# EAGLE board IoT4Bees-Ctrl_1V1 (EAGLE 7.7.0), part 1 of 2
DL0WH Antenna BiTuner
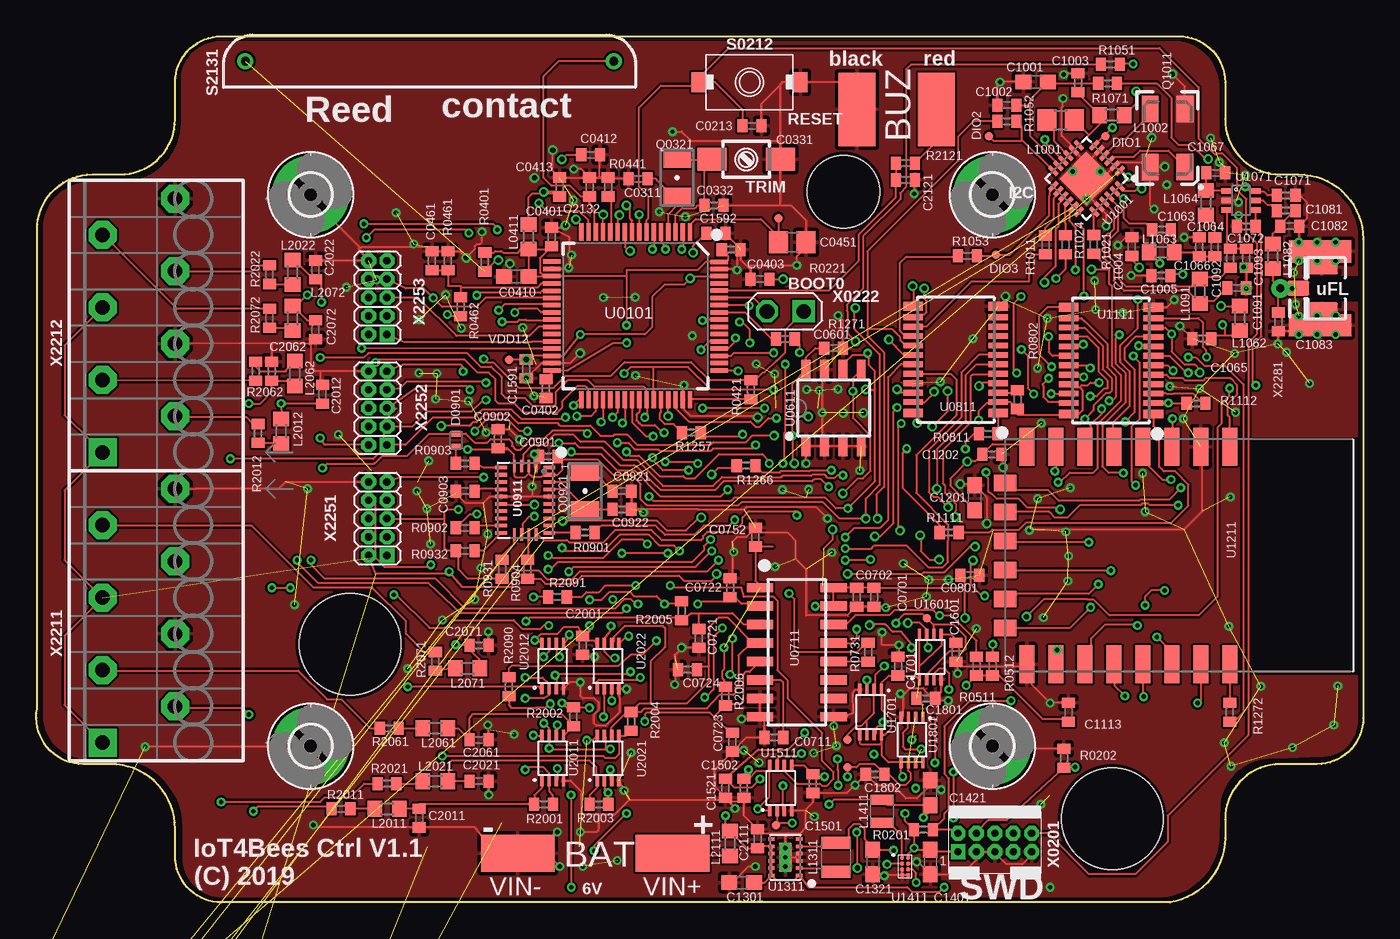
[diagram p23: board, top side]
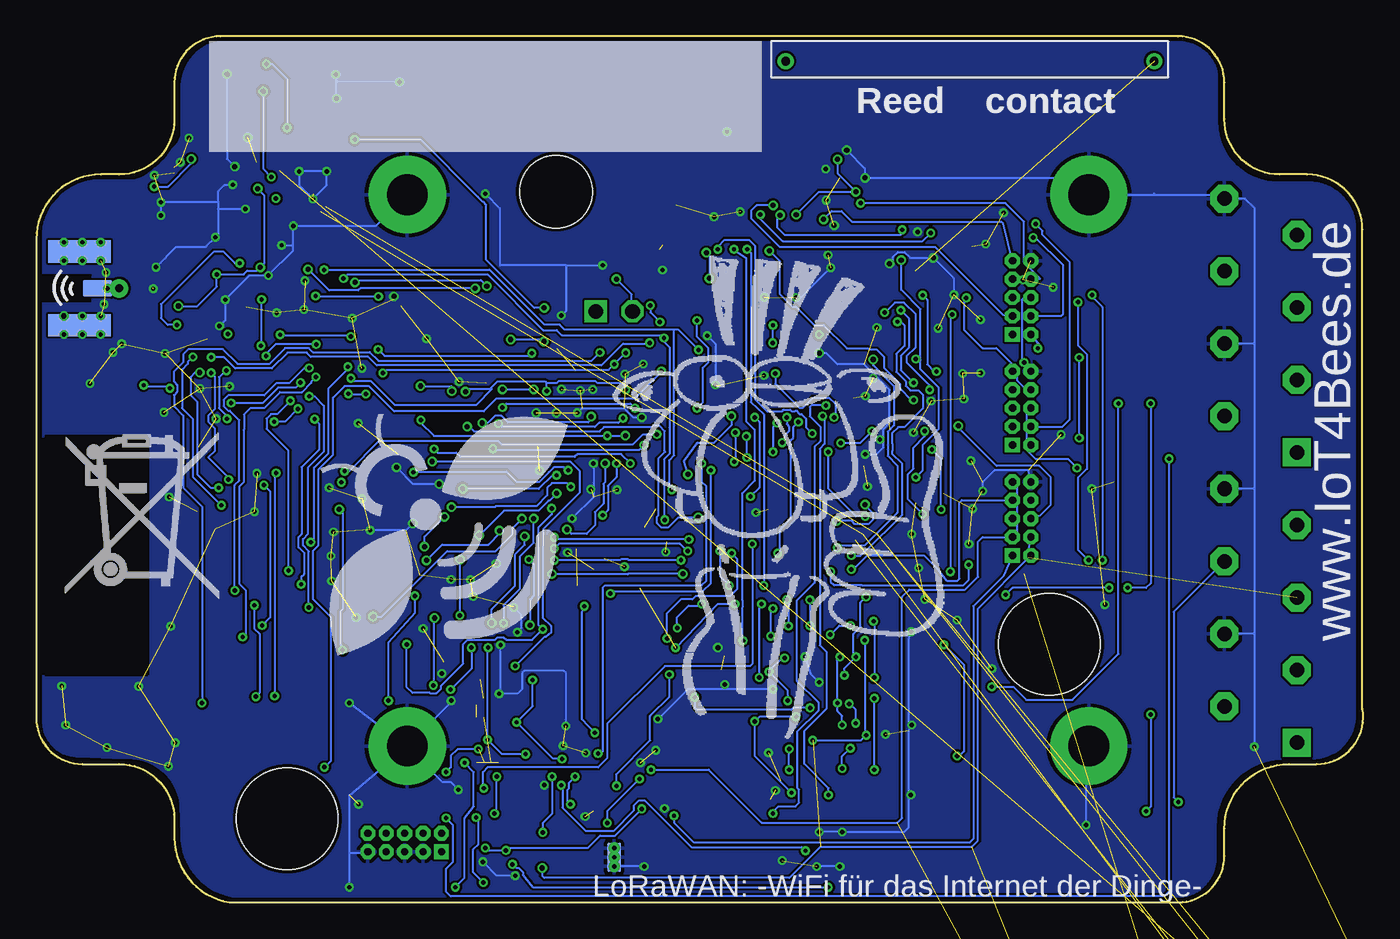
[diagram p24: board, bottom side, seen from below]

Size 91.49 x 59.69 mm. Coordinates in mm from the lower left corner, seen from the top.
Outline: 91.49,45.72 91.49,12.7 arc-90 88.32,9.53 85.78,9.53 arc90 81.97,5.72 81.97,4.45 arc-81 78.16,0 12.75,0 arc-90 9.58,3.18 9.58,5.08 arc90 5.13,9.53 3.23,9.53 arc-100 0.05,13.34 0.05,46.36 arc-90 3.86,50.17 5.77,50.17 arc90 9.58,53.98 9.58,56.52 arc-90 12.75,59.69 78.79,59.69 arc-90 81.97,56.52 81.97,53.98 arc90 85.78,50.17 87.05,50.17 arc-90 91.49,45.72
Copper layers (1*16): Top 0.035mm / dielectric 1.5mm / Bottom 0.035mm
Design rules "IoT4Bees-Ctrl_1V0 *": minimum track width 6mil, minimum drill 0.3mm, track to track 6mil, track to pad 6mil, pad to pad 6mil, via to via 6mil, smd to smd 0mil, copper to edge 10mil, drill to drill 10mil, minimum pad ring 10mil, minimum via ring 6mil, stop-mask expansion 2mil, vias tented up to drill 25mil, thermal gap 10mil
Net classes: 0 default: drill 0.3 mm; 1 pwr_relay: width 1.5 mm, clearance 0.5 mm; 2 pwr_ttl: width 0.75 mm, clearance 0.5 mm; 3 usb_pair: width 0.254 mm, clearance 0.152 mm; 4 pwrA5: width 0.4 mm; 5 single50R: width 0.838 mm, clearance 0.152 mm; 6 mil6_nofill: width 0.152 mm, clearance 0.254 mm
Holes 7 mm at 21.66,17.79 74.18,5.77
Holes 5 mm at 55.66,48.99
tKeepout: area 14.7,13.7 to 19.7,45.5
tRestrict: area 87.8,43 to 91.1,43.1; area 87.8,41.5 to 91.2,41.7; area 83.7,15.7 to 91.3,32
bRestrict: area 83.9,15.6 to 90.9,32.2; area 87.7,43 to 91.2,43.2; area 87.8,41.4 to 91.1,41.7; area 83.7,15.7 to 91.3,32

## Footprints (pad centres in the part's own frame; a part is rotated, then mirrored left to right if it is on the bottom)
SMD2,54-5,08 = smd 2.54 x 5.08: 1 0,0
C0402 = smd 0.7 x 0.9: 1 -0.65,0; 2 0.65,0
3MM2_X_2MM5 = smd 2 x 1.6: + -2.365,0; - 2.365,0
C0603 = smd 1.1 x 1: 1 -0.85,0; 2 0.85,0
C0805 = smd 1.3 x 1.5: 1 -0.95,0; 2 0.95,0
SOD923 = smd 0.4 x 0.6: A 0.45,0; C -0.45,0
2,8-PAD = drill 2.8 pad 5.334: B2,8 0,0
L0603 = smd 1 x 1.1: 1 -0.85,0; 2 0.85,0
L0805 = smd 1.3 x 1.5: 1 -0.95,0; 2 0.95,0
L2520 = smd 0.8 x 2: 1 -1,0; 2 1,0
L2016 = smd 0.7 x 1.6: 1 -0.8,0; 2 0.8,0
ABS07 = smd 1.1 x 1.9: 1 -1.25,0; 2 1.25,0
ABM3B = smd 1.8 x 1.2: 1 -2,-1.2; 2 2,-1.2; 3 2,1.2; 4 -2,1.2
R0402 = smd 0.7 x 0.9: 1 -0.65,0; 2 0.65,0
KSR223G_SMD_1POL = smd 1 x 1.4: 1 -3.5,0; 2 3.5,0
MK6-10 = drill 0.6 pad 1.016: 1 -12.7,0; 2 12.7,0
TP06R = smd 0.6 x 0.6: TP 0,0
LQFP64 = smd 1.2 x 0.3: 1 -5.775,3.75; 2 -5.775,3.25; 3 -5.775,2.75; 4 -5.775,2.25; 5 -5.775,1.75; 6 -5.775,1.25; 7 -5.775,0.75; 8 -5.775,0.25; 9 -5.775,-0.25; 10 -5.775,-0.75; 11 -5.775,-1.25; 12 -5.775,-1.75; 13 -5.775,-2.25; 14 -5.775,-2.75; 15 -5.775,-3.25; 16 -5.775,-3.75; 33 5.775,-3.75; 34 5.775,-3.25; 35 5.775,-2.75; 36 5.775,-2.25; 37 5.775,-1.75; 38 5.775,-1.25; 39 5.775,-0.75; 40 5.775,-0.25; 41 5.775,0.25; 42 5.775,0.75; 43 5.775,1.25; 44 5.775,1.75; 45 5.775,2.25; 46 5.775,2.75; 47 5.775,3.25; 48 5.775,3.75 | smd 0.3 x 1.2: 17 -3.75,-5.775; 18 -3.25,-5.775; 19 -2.75,-5.775; 20 -2.25,-5.775; 21 -1.725,-5.775; 22 -1.25,-5.775; 23 -0.75,-5.775; 24 -0.25,-5.775; 25 0.25,-5.775; 26 0.75,-5.775; 27 1.25,-5.775; 28 1.75,-5.775; 29 2.25,-5.775; 30 2.75,-5.775; 31 3.25,-5.775; 32 3.75,-5.775; 49 3.75,5.775; 50 3.25,5.775; 51 2.75,5.775; 52 2.25,5.775; 53 1.75,5.775; 54 1.25,5.775; 55 0.75,5.775; 56 0.25,5.775; 57 -0.25,5.775; 58 -0.75,5.775; 59 -1.25,5.775; 60 -1.75,5.775; 61 -2.25,5.775; 62 -2.75,5.775; 63 -3.25,5.775; 64 -3.725,5.775
SOIC8_150MIL = smd 0.6 x 1.4: 1 -1.905,-2.63; 2 -0.635,-2.63; 3 0.635,-2.63; 4 1.905,-2.63; 5 1.905,2.63; 6 0.635,2.63; 7 -0.635,2.63; 8 -1.905,2.63
LSOP16 = smd 0.65 x 1.8: 1 -4.445,-2.54; 2 -3.175,-2.54; 3 -1.905,-2.54; 4 -0.635,-2.54; 5 0.635,-2.54; 6 1.905,-2.54; 7 3.175,-2.54; 8 4.445,-2.54; 9 4.445,2.54; 10 3.175,2.54; 11 1.905,2.54; 12 0.635,2.54; 13 -0.635,2.54; 14 -1.905,2.54; 15 -3.175,2.54; 16 -4.445,2.54
TSSOP24_SOT355-1 = smd 0.6 x 1.35: 1 -3.675,-2.925; 12 3.675,-2.925; 13 3.675,2.925; 24 -3.675,2.925 | smd 0.4 x 1.35: 2 -2.925,-2.925; 3 -2.275,-2.925; 4 -1.625,-2.925; 5 -0.975,-2.925; 6 -0.325,-2.925; 7 0.325,-2.925; 8 0.975,-2.925; 9 1.625,-2.925; 10 2.275,-2.925; 11 2.925,-2.925; 14 2.925,2.925; 15 2.275,2.925; 16 1.625,2.925; 17 0.975,2.925; 18 0.325,2.925; 19 -0.325,2.925; 20 -0.975,2.925; 21 -1.625,2.925; 22 -2.275,2.925; 23 -2.925,2.925
BNO085_LGA28 = smd 0.25 x 0.875: 1 -2.25,1.663; 6 -2.25,-1.663; 7 -1.75,-1.663; 8 -1.25,-1.663; 9 -0.75,-1.663; 10 -0.25,-1.663; 11 0.25,-1.663; 12 0.75,-1.663; 13 1.25,-1.663; 14 1.75,-1.663; 15 2.25,-1.663; 20 2.25,1.663; 21 1.75,1.663; 22 1.25,1.663; 23 0.75,1.663; 24 0.25,1.663; 25 -0.25,1.663; 26 -0.75,1.663; 27 -1.25,1.663; 28 -1.75,1.663 | smd 0.875 x 0.25: 2 -2.362,0.75; 3 -2.362,0.25; 4 -2.362,-0.25; 5 -2.362,-0.75; 16 2.362,-0.75; 17 2.362,-0.25; 18 2.362,0.25; 19 2.362,0.75
QFN24-4X4-0P5-PAD = smd 0.8 x 0.3: 1 -2,1.25; 2 -2,0.75; 3 -2,0.25; 4 -2,-0.25; 5 -2,-0.75; 6 -2,-1.25; 13 2,-1.25; 14 2,-0.75; 15 2,-0.25; 16 2,0.25; 17 2,0.75; 18 2,1.25 | smd 0.3 x 0.8: 7 -1.25,-2; 8 -0.75,-2; 9 -0.25,-2; 10 0.25,-2; 11 0.75,-2; 12 1.25,-2; 19 1.25,2; 20 0.75,2; 21 0.25,2; 22 -0.25,2; 23 -0.75,2; 24 -1.25,2 | smd 2.65 x 2.65: 25 0,0
SC-70_6-LEAD_2X1MM25_0P65 = smd 0.4 x 0.8: 1 -0.65,-1; 2 0,-1; 3 0.65,-1; 4 0.65,1; 5 0,1; 6 -0.65,1
ESP-12F__2P00_24MM-X-16MM = smd 2.6 x 1.1: 1 -7.5,3.5; 2 -7.5,1.5; 3 -7.5,-0.5; 4 -7.5,-2.5; 5 -7.5,-4.5; 6 -7.5,-6.5; 7 -7.5,-8.5; 8 -7.5,-10.5; 15 7.5,-10.5; 16 7.5,-8.5; 17 7.5,-6.5; 18 7.5,-4.5; 19 7.5,-2.5; 20 7.5,-0.5; 21 7.5,1.5; 22 7.5,3.5 | smd 1.1 x 1.6: 9 -5,-12; 10 -3,-12; 11 -1,-12; 12 1,-12; 13 3,-12; 14 5,-12
WSON-12 = smd 0.5 x 0.25: 1 -0.95,1.25; 2 -0.95,0.75; 3 -0.95,0.25; 4 -0.95,-0.25; 5 -0.95,-0.75; 6 -0.95,-1.25; 7 0.95,-1.25; 8 0.95,-0.75; 9 0.95,-0.25; 10 0.95,0.25; 11 0.95,0.75; 12 0.95,1.25 | smd 0.9 x 2: 13 0,0 | smd 0.9 x 2 bottom: 14 0,0 | drill 0.3 pad 0.6: G1 0,0; G2 0,0.635; G3 0,-0.635
WCSP-8 = smd 0.27 x 0.27: 1A -0.2,0.6; 1B -0.2,0.2; 1C -0.2,-0.2; 1D -0.2,-0.6; 2A 0.2,0.6; 2B 0.2,0.2; 2C 0.2,-0.2; 2D 0.2,-0.6
R-PDSO-G8 = smd 0.25 x 0.75: 1 -0.75,-1.55; 2 -0.25,-1.55; 3 0.25,-1.55; 4 0.75,-1.55; 5 0.75,1.55; 6 0.25,1.55; 7 -0.25,1.55; 8 -0.75,1.55
2X05_1MM27_SHROUDED_CORTEX_JTAG_SWD = drill 0.5 pad 0.914 square: 1 -2.54,-0.635 | drill 0.5 pad 0.914 octagon: 2 -2.54,0.635; 3 -1.27,-0.635; 4 -1.27,0.635; 5 0,-0.635; 6 0,0.635; 7 1.27,-0.635; 8 1.27,0.635; 9 2.54,-0.635; 10 2.54,0.635
1X02 = drill 1.016 square: 1 0,0 | drill 1.016 octagon: 2 0,2.54
SMA_UFL_PAD_TINY = smd 1.524 x 1.016: ANT1 -3.843,0 | drill 0.559 pad 1.27: ANT2 -5.08,0 | smd 2.032 x 1.143 bottom: ANT3 -3.589,0 | smd 2.2 x 1.016: GND1 -2.223,1.47; GND2 -2.223,-1.47 | smd 4.318 x 1.524: GND3 -2.349,-2.54; GND4 -2.349,2.54 | smd 4.318 x 1.524 bottom: GND5 -2.349,2.54; GND6 -2.349,-2.54
PHOENIX_1990067_1X8X2MM50_PTSA-0-5 = drill 1 pad 1.93 square: 1 -7.5,5 | drill 1 pad 1.93 octagon: 2 -5,0; 3 -2.5,5; 4 0,0; 5 2.5,5; 6 5,0; 7 7.5,5; 8 10,0
2X05_1MM27 = drill 0.508 pad 0.813 square: 1 -2.54,-0.635 | drill 0.508 pad 0.813 octagon: 2 -2.54,0.635; 3 -1.27,-0.635; 4 -1.27,0.635; 5 0,-0.635; 6 0,0.635; 7 1.27,-0.635; 8 1.27,0.635; 9 2.54,-0.635; 10 2.54,0.635

## Placement (x,y rotation side)
BUZZER+  CUI Inc. CEB-44D06  [SMD2,54-5,08]  62.05,54.64 180 top
BUZZER-  CUI Inc. CEB-44D06  [SMD2,54-5,08]  56.59,54.65 180 top
C0213  100nF  [C0402]  49.34,53.51 0 top
C0311  22pF  [C0402]  41.49,49.86 180 top
C0331  JR200  [3MM2_X_2MM5]  48.95,51.21 180 top
C0332  0pF  [C0402]  46.73,48.03 0 top
C0401  100nF  [C0402]  35.53,45.86 90 top
C0402  100nF  [C0402]  35.14,35.41 270 top
C0403  100nF  [C0402]  47.92,44.99 0 top
C0410  4.7uF  [C0603]  33.09,43.13 0 top
C0412  10nF  [C0402]  38.23,51.52 0 top
C0413  1uF  [C0402]  36.09,49.3 90 top
C0451  47uF  [C0805]  52.12,45.49 0 top
C0461  100nF  [C0402]  27.28,44.22 90 top
C0601  100nF  [C0402]  54.98,38.19 180 top
C0701  100nF  [C0402]  57.76,21.03 270 top
C0702  100nF  [C0402]  56.57,21.03 270 top
C0711  100nF  [C0402]  50.85,11.36 180 top
C0721  100nF  [C0402]  45.69,18.19 270 top
C0722  100nF  [C0402]  47.84,21.68 90 top
C0723  100nF  [C0402]  48,11.04 270 top
C0724  100nF  [C0402]  44.9,16.04 180 top
C0752  100nF  [C0402]  49.58,25.17 90 top
C0801  100nF  [C0402]  64.37,22.54 0 top
C0901  100nF  [C0402]  35.3,30.73 180 top
C0902  100nF  [C0402]  31.84,31.94 90 top
C0903  100nF  [C0402]  29.58,28.35 180 top
C0921  22pF  [C0402]  40.38,28.35 0 top
C0922  22pF  [C0402]  40.38,27.08 0 top
C1001  10uF  [C0603]  68.9,56.55 180 top
C1002  10nF  [C0402]  66.92,54.94 180 top
C1003  470nF  [C0402]  71.82,56.49 90 top
C1004  47pF  [C0402]  75.53,45.2 90 top
C1005  47nF  [C0402]  77.54,43.19 180 top
C1006  10nF  [C0402]  -5.66,-18.01 0 top  (outside the outline)
C1063  3.3pF  [C0402]  77.59,46.37 0 top
C1064  22pF  [C0402]  81.26,45.17 90 top
C1065  1.8pF  [C0402]  80.35,38.85 0 top
C1066  3.3pF  [C0402]  80.19,45.19 90 top
C1067  0.0pF  [C0402]  81.32,50.27 0 top
C1071  1nF  [C0402]  86.17,48.73 0 top
C1072  1nF  [C0402]  83.42,46.59 180 top
C1081  33pF  [C0402]  86.17,47.67 0 top
C1082  2.7pF  [C0402]  86.43,46.61 180 top
C1083  2.2pF  [C0402]  85.65,40.01 90 top
C1091  2.7pF  [C0402]  82.77,42.34 180 top
C1092  3.8pF  [C0402]  82.32,44.39 90 top
C1093  0pF  [C0402]  83.42,44.39 90 top
C1113  100nF  [C0402]  71.17,13.11 90 top
C1201  10uF  [C0603]  64.71,27.88 90 top
C1202  10nF  [C0402]  65.88,30.87 0 top
C1301  10uF  [C0603]  48.63,1.36 180 top
C1321  10uF  [C0603]  57.68,2.79 270 top
C1401  4.7uF  [C0603]  61.65,2.79 270 top
C1421  10uF  [C0603]  61.65,7.55 90 top
C1501  100nF  [C0402]  53.55,8.19 270 top
C1502  100nF  [C0402]  48.79,7.87 270 top
C1521  100nF  [C0402]  47.52,7.87 270 top
C1591  100nF  [C0402]  33.79,36.76 90 top
C1592  100nF  [C0402]  46.86,46.1 0 top
C1601  100nF  [C0402]  63.39,17.23 270 top
C1701  100nF  [C0402]  59.43,16.28 90 top
C1801  100nF  [C0402]  61.33,14.06 0 top
C1802  100nF  [C0402]  57.84,8.82 180 top
C1901  100nF  [C0402]  2.59,-58.01 0 top  (outside the outline)
C1902  100nF  [C0402]  -5.66,-65 0 top  (outside the outline)
C2001  100nF  [C0402]  37.68,17.71 270 top
C2011  100nF  [C0402]  26.41,5.8 270 top
C2012  100nF  [C0402]  19.74,35.01 90 top
C2021  100nF  [C0402]  30.53,8.34 0 top
C2022  100nF  [C0402]  19.26,43.59 90 top
C2061  100nF  [C0402]  30.53,11.2 0 top
C2062  100nF  [C0402]  16.25,36.6 90 top
C2071  100nF  [C0402]  30.53,17.71 0 top
C2072  100nF  [C0402]  19.26,39.46 270 top
C2111  10pF  [C0402]  49.74,4.38 90 top
C2121  10nF  [C0402]  59.92,49.78 0 top
C2132  10pF  [C0402]  38.15,49.3 90 top
D0901  CMAD6001  [SOD923]  28.95,31.84 270 top
H2311  MOUNT-PAD-ROUND2.8  [2,8-PAD]  18.92,10.77 0 top
H2321  MOUNT-PAD-ROUND2.8  [2,8-PAD]  65.92,10.77 0 top
H2331  MOUNT-PAD-ROUND2.8  [2,8-PAD]  18.92,48.77 0 top
H2341  MOUNT-PAD-ROUND2.8  [2,8-PAD]  65.92,48.77 0 top
L0411  10uH  [L0603]  33.94,45.87 90 top
L1001  15uH  [L0805]  70.63,53.92 0 top
L1002  47nH  [L0603]  74.17,54.25 180 top
L1062  47nH  [L0603]  82.98,40.26 90 top
L1063  2.2nH  [L0603]  77.59,44.81 180 top
L1064  1.5nH  [L0603]  80.63,48.22 270 top
L1082  6.8nH  [L0603]  85.25,44.54 90 top
L1091  13nH  [L0603]  80.23,42.13 270 top
L1311  4.7uH  [L2520]  55.14,3.11 270 top
L1411  2.2uH  [L2016]  58.31,6.28 270 top
L2011  10uH  [L0603]  24.18,6.44 180 top
L2012  10uH  [L0603]  16.88,32.47 270 top
L2021  10uH  [L0603]  27.52,8.34 0 top
L2022  10uH  [L0603]  17.67,43.43 90 top
L2061  10uH  [L0603]  27.52,12 180 top
L2062  10uH  [L0603]  17.83,36.44 90 top
L2071  10uH  [L0603]  29.74,16.12 0 top
L2072  10uH  [L0603]  17.67,40.25 90 top
L2111  10uH  [L0603]  47.84,4.06 270 top
Q0321  ABS07-32.768KHZ-7-1-T 7pF  [ABS07]  44.19,49.94 90 top
Q0921  ABS07-32.768KHZ  [ABS07]  37.84,28.35 90 top
Q1011  ABM3B-32.0000MHZ  [ABM3B]  77.99,52.68 90 top
R0201  220kR  [R0402]  61.17,5.01 180 top
R0202  220kR  [R0402]  70.86,9.93 270 top
R0221  33kR  [R0402]  49.9,42.95 0 top
R0401  0R  [R0402]  30.93,44.13 90 top
R0421  0R  [R0402]  49.27,35.33 270 top
R0441  0R  [R0402]  39.42,49.3 270 top
R0461  47kR  [R0402]  28.39,44.22 270 top
R0462  100kR  [R0402]  29.26,41.05 270 top
R0511  1kR  [R0402]  64.82,16.28 270 top
R0512  1kR  [R0402]  65.93,16.28 270 top
R0551  3R  [R0402]  -5.03,-22.45 0 top  (outside the outline)
R0552  3R  [R0402]  -5.03,-26.9 0 top  (outside the outline)
R0731  47R  [R0402]  57.36,17.23 270 top
R0802  100kR  [R0402]  67.65,34.65 270 top
R0811  3R  [R0402]  65.64,32.28 0 top
R0901  3R  [R0402]  37.84,25.49 180 top
R0902  3R  [R0402]  29.58,25.81 0 top
R0903  47R  [R0402]  29.58,30.25 0 top
R0904  3R  [R0402]  33.87,22.95 90 top
R0931  3.9kR  [R0402]  32.12,22.95 270 top
R0932  3.9kR  [R0402]  29.58,24.22 180 top
R1011  3R  [R0402]  69.59,45.31 90 top
R1021  3R  [R0402]  72.92,45.34 90 top
R1024  3R  [R0402]  70.97,45.33 90 top
R1051  47R  [R0402]  74.06,57.76 180 top
R1052  47R  [R0402]  66.92,53.82 180 top
R1053  47R  [R0402]  64.2,44.55 180 top
R1071  47R  [R0402]  73.87,56.45 180 top
R1111  3R  [R0402]  62.94,25.49 0 top
R1112  100kR  [R0402]  79.96,34.39 180 top
R1257  47R  [R0402]  45.16,32.38 180 top
R1266  47R  [R0402]  48.95,30.09 180 top
R1271  47R  [R0402]  51.65,38.82 180 top
R1272  47R  [R0402]  82.29,13.11 270 top
R2001  0R  [R0402]  34.98,6.76 180 top
R2002  0R  [R0402]  37.04,12.79 270 top
R2003  0R  [R0402]  38.79,6.76 0 top
R2004  0R  [R0402]  41.01,12.47 90 top
R2005  22kR  [R0402]  44.5,20.09 90 top
R2006  22kR  [R0402]  47.52,14.22 90 top
R2011  47R  [R0402]  21.01,6.44 180 top
R2012  47R  [R0402]  15.29,32.32 90 top
R2021  47R  [R0402]  24.18,8.19 0 top
R2022  47R  [R0402]  16.09,43.27 270 top
R2061  47R  [R0402]  24.34,12 180 top
R2062  47R  [R0402]  15.13,36.6 270 top
R2071  47R  [R0402]  27.52,16.6 270 top
R2072  47R  [R0402]  16.09,40.25 270 top
R2090  47R  [R0402]  32.6,14.85 270 top
R2091  47R  [R0402]  35.93,21.04 180 top
R2121  1kR  [R0402]  59.92,50.95 180 top
S0212  KSR223GLFG  [KSR223G_SMD_1POL]  49.19,56.52 180 top
S2131  REED-SWITCH-MK6-10  [MK6-10]  27.12,57.97 180 top
TP_+1V2_MCU  PTR1TP06R  [TP06R]  32.6,37.4 270 top
TP_+3V3_BRIDGES  PTR1TP06R  [TP06R]  55.93,9.3 0 top
TP_+3V3_I2C1  PTR1TP06R  [TP06R]  51.01,5.33 0 top
TP_+3V3_SPI3  PTR1TP06R  [TP06R]  61.41,19.57 0 top
TP_+3V3_USART1  PTR1TP06R  [TP06R]  55.93,11.2 0 top
TP_BAT_VOLTAGE1  PTR1TP06R  [TP06R]  -6.3,-72.62 0 top  (outside the outline)
TP_SX_DIO1  PTR1TP06R  [TP06R]  66.17,44.64 0 top
TP_SX_DIO2  PTR1TP06R  [TP06R]  65.69,52.81 0 top
TP_SX_DIO3  PTR1TP06R  [TP06R]  73.71,52.81 0 top
TP_VBAT  PTR1TP06R  [TP06R]  51.17,47.16 270 top
U0101  STM32L452RET_64PIN_SMPS  [LQFP64]  41.33,40.41 270 top
U0611  MR44V064BMAZAATL  [SOIC8_150MIL]  54.98,34.06 0 top
U0711  NAU7802SGI  [LSOP16]  52.44,17.23 270 top
U0811  PCAL6416APW  [TSSOP24_SOT355-1]  63.4,37.4 90 top
U0911  BNO085  [BNO085_LGA28]  33.71,27.71 270 top
U1001  SX1261IMLTRT  [QFN24-4X4-0P5-PAD]  72.41,49.88 225 top
U1071  PE4259  [SC-70_6-LEAD_2X1MM25_0P65]  83.07,48.37 270 top
U1111  PCAL6416APW  [TSSOP24_SOT355-1]  74.09,37.34 90 top
U1211  ESP-12F__2P00_24MM-X-16MM  [ESP-12F__2P00_24MM-X-16MM]  78.79,23.9 270 top
U1311  TPS62745DSSR  [WSON-12]  51.65,3.11 180 top
U1411  TPS62743YFPR  [WCSP-8]  59.9,2.47 0 top
U1511  TS5A23166  [R-PDSO-G8]  51.33,7.87 0 top
U1601  TS5A23166  [R-PDSO-G8]  61.65,16.92 0 top
U1701  TS5A23166  [R-PDSO-G8]  57.52,13.11 180 top
U1801  TS5A23166  [R-PDSO-G8]  60.38,11.2 180 top
U2011  TS5A23166  [R-PDSO-G8]  35.61,9.93 0 top
U2012  TS5A23166  [R-PDSO-G8]  35.61,16.28 0 top
U2021  TS5A23166  [R-PDSO-G8]  39.42,9.93 0 top
U2022  TS5A23166  [R-PDSO-G8]  39.42,16.28 0 top
VIN+  6V  [SMD2,54-5,08]  43.87,3.38 90 top
VIN-  6V  [SMD2,54-5,08]  33.2,3.38 90 top
X0201  FTSH-105-01-F-D-K  [2X05_1MM27_SHROUDED_CORTEX_JTAG_SWD]  66.09,4.12 0 top
X0222  [1X02]  52.92,40.73 90 top
X1081  ANTENNATINY  [SMA_UFL_PAD_TINY]  90.86,42.32 0 top
X2211  PHOENIX_1990067_1X8X2MM50_PTSA-0-5  [PHOENIX_1990067_1X8X2MM50_PTSA-0-5]  9.58,18.5 90 top
X2212  PHOENIX_1990067_1X8X2MM50_PTSA-0-5  [PHOENIX_1990067_1X8X2MM50_PTSA-0-5]  9.58,38.51 90 top
X2251  [2X05_1MM27]  23.55,26.44 90 top
X2252  [2X05_1MM27]  23.55,34.06 90 top
X2253  [2X05_1MM27]  23.55,41.68 90 top

## Tracks (layer width: path | path; a pad name or v marks a point on that pad's centre or on a via)
+1V2_SMPS_PWR  (via drill 0.3)
  Top 0.152: U1411.2C 60.42,2.27 60.67,2.02 v60.67,1.36 | v61.17,5.84 61.65,6.32 C1421.1 58.69,6.7 L1411.1 54.99,7.08 v54.66,6.76 | v54.35,8.66 53.72,8.66 C1501.1 52.97,9.42 U1511.5
  Bottom 0.152: v60.67,1.36 61.37,2.06 61.37,3.64 61.01,4 61.01,5.65 61.17,5.8 v61.17,5.84 | v54.66,6.76 54.87,6.96 54.87,7.75 54.77,7.85 54.77,8.24 v54.35,8.66
+3V3  (via drill 0.3, 0.35)  (5 unrouted)
  Top 0.152: C1601.1 63.39,18.14 63.07,18.47 U1601.5 62.41,18.32 62.41,18 62.42,17.69 60.9,16.27 | U1311.5 54.89,3.86 L1311.1 55.25,4.22 55.93,4.22 56.01,4.3 56.01,5.05 56.34,5.38 56.8,5.38 57.12,5.05 57.12,4.35 57.84,3.64 | U1411.2A 60.1,3.31 v60.52,3.74 | v30.85,29.3 25.14,29.3 X2251.9 | X0222.1 51.65,39.46 51.65,37.91 51.07,37.34 51.04,37.34 50.22,36.52 50.11,36.52 49.56,35.97 49.28,35.97 R0421.1 46.42,35.98 46.41,35.97 45.15,37.22 40.56,37.22 39.62,36.28 36.51,36.28 35.68,35.45 33.26,35.45 31.5,37.22 31.08,37.22 v30.85,37.45 | C1321.1 57.84,3.64 | 57.84,3.64 59.05,3.64 v59.11,3.58 | X0201.1 62.03,3.49 61.88,3.64 C1401.1 60.63,3.64 v60.52,3.74 | v59.9,6.12 59.9,5.63 R0201.2 v60.52,3.74 | v59.74,8.66 59.63,8.78 U1801.5 58.75,9.65 58.31,10.09 58.31,11.51 U1701.8 | U1701.5 56.77,11 56.89,10.88 58.15,10.88 58.27,11 U1701.8 | 60.9,16.27 U1601.1 60.63,15.63 C1701.1 58.78,15.63 58.27,15.13 U1701.1 58.31,14.61 58.31,13.27 58.95,12.63 58.95,12 58.51,11.56 U1701.8 | 60.9,16.27 U1601.8 | U1511.1 49.86,6.32 v49.74,6.44 50.53,7.23 50.53,8.98 | U1511.8 50.53,9.42 50.53,8.98 | 50.53,8.98 50.61,9.06 49.67,9.06 49.13,8.52 C1502.1 48.79,8.82 v49.11,9.14 | R0401.1 31.7,44.26 v31.86,44.26 | 61.13,13.61 C1801.1
  Bottom 0.152: v30.85,29.3 30.37,29.78 30.37,31.52 29.26,32.63 29.26,35.46 30.53,36.73 30.53,37.39 | X2251.9 23.87,28.66 23.87,25.49 X2251.3 26.25,25.17 26.56,24.85 26.56,22.44 27.46,21.55 31.3,21.55 31.8,21.04 31.8,5.8 32.12,5.49 41.49,5.49 45.14,9.14 v49.11,9.14 | v60.52,3.74 60.36,3.58 v59.11,3.58 58.94,3.75 53.46,3.75 52.61,4.59 51.59,4.59 v49.74,6.44 | v59.9,6.12 59.74,6.28 v59.74,8.66 | 30.53,37.39 30.58,37.45 v30.85,37.45 | 30.53,37.39 30.53,40.88 31.86,42.21 v31.86,44.26
+3V3_BRIDGE_PWR  (via drill 0.3, 0.35)  (5 unrouted)
  Top 0.152: U2022.8 38.48,18.03 37.98,18.03 37.98,18.06 C2001.1 | v34.26,11.52 34.3,11.48 U2011.8 | v38.15,19.06 38.15,18.68 C2001.1 | R2006.2 47.41,14.97 47.41,15.33 47.28,15.47 47.28,15.93 47.41,16.06 v47.41,17.55 | C2001.1 37.68,18.5 37.52,18.66 37.36,18.98 36.41,18.98 35.93,18.5 34.82,18.5 v34.37,18.06 34.44,18.06 34.52,18.14 34.84,17.83 U2012.8 | U2021.8 38.36,11.16 v37.96,11.16 | R2005.2 44.33,20.57 v43.31,20.57 42.78,21.1 41.23,21.1 40.93,21.4 39.54,21.4 38.98,20.85 v38.15,20.85 | U1801.6 60.13,9.06 60.3,8.89 60.3,8.43 59.97,8.11 59.51,8.11 58.8,8.82 C1802.1 57.81,9.5 56.74,9.5 56.54,9.3 TP_+3V3_BRIDGES.TP v55.93,8.66 | v56.57,4.82 56.57,2.36 v56.62,2.36 | X2212.5 1.96,38.39 1.96,33.59 3.74,31.8 X2212.1 1.96,28.39 1.96,23.58 3.74,21.8 X2211.5 1.96,18.38 1.96,13.58 4.42,11.12 4.5,11.04 4.54,11 X2211.1 | U0711.1 49.9,21.84 49.58,22.16 C0752.1 50.76,24.52
  Bottom 0.152: v37.96,11.16 34.62,11.16 v34.26,11.52 34.34,11.6 34.34,18.04 34.37,18.06 v34.37,18.06 | v38.15,20.85 v38.15,19.06 | v47.41,17.55 47.41,17.5 44.5,20.57 v43.31,20.57 | X2251.4 23.07,24.38 23.07,23.74 26.58,20.23 26.58,4.25 26.99,3.83 37.42,3.83 39.57,1.68 56.48,1.68 56.62,1.81 v56.62,2.36 | v55.93,8.66 55.93,6.1 56.57,5.46 v56.57,4.82
+3V3_I2C1_PWR  (via drill 0.3, 0.35)  (1 unrouted)
  Top 0.152: U1511.2 51.08,5.4 TP_+3V3_I2C1.TP 51.15,5.46 v52.12,5.46 | U0711.16 U0711.15 v53.71,20.41 | C0601.2 53.71,38.19 53.07,37.55 U0611.8 52.12,35.74 52.12,33.5 | v52.99,11.69 51.82,10.52 49.8,10.52 47.61,8.62 47.67,8.52 C1521.1 48.1,7.94 49.33,7.94 v49.9,8.5 | 52.12,33.5 v52.12,32.16 52.12,30.4 v52.27,30.25 | U0711.16 C0702.1 C0701.1 57.81,21.63 63.75,21.63 64.04,21.92 | C1113.1 71.35,12.63 69.41,12.63 66.41,15.63 R0512.2 R0511.2 64.8,15.63 v64.12,14.95 | v50.88,32.16 49.36,32.16 48.92,31.72 46.66,31.72 46.47,31.53 41.44,31.53 40.75,32.21 39.84,32.21 39.78,32.16 38.9,32.16 38.21,32.85 36.12,32.85 35.96,33.01 33.23,33.01 32.64,33.6 30.87,33.6 30.35,33.08 30.09,33.08 29.86,32.85 v27.91,32.85 | U0711.16 54.35,21.68 54.2,21.82 | U1111.21 71.39,35.49 71.94,35.49 | 71.94,35.49 72.14,35.29 72.14,33.91 71.89,33.66 U1111.24 71.12,33.62 67.65,33.62 R0802.2 67.17,34.48 U0811.2 66.26,34.41 65.52,34.41 64.97,33.86 v64.97,33.25 | U1111.2 v78.06,34.41 79.29,34.41 R1112.2 | 71.94,35.49 72.09,35.64 72.51,35.64 72.69,35.82 v73.27,35.82 | C0801.1 64.04,22.22 64.04,21.92 | v64.04,19.6 64.04,21.92 | U0811.24 60.74,33.73 v60.74,33.03 | v53.24,33.48 52.15,33.48 52.12,33.5 | v54.9,25.7 54.9,25 54.28,24.38
  Bottom 0.152: v49.9,8.5 52.12,6.28 v52.12,5.46 | v52.99,11.69 53.87,12.61 53.85,20.03 v53.71,20.41 | v64.97,33.25 65.03,33.25 65.03,33.09 64.08,32.14 52.14,32.14 v52.12,32.16 v50.88,32.16 | v64.12,14.95 64.08,14.99 64.08,19.55 v64.04,19.6 | X2251.6 22.28,26.67 21.54,27.41 21.54,29.29 22.33,30.08 25.28,30.08 27.99,32.79 v27.91,32.85 | v73.27,35.82 73.62,35.47 74.82,35.47 75.87,34.41 v78.06,34.41 | v53.24,33.48 53.24,33.28 53.43,33.09 58.97,33.09 59.42,33.53 59.86,33.53 60.36,33.03 v60.74,33.03 | v52.27,30.25 52.27,28.95 52.39,28.83 52.39,27.48 52.97,26.9 52.97,25.97 53.54,25.4 54.6,25.4 v54.9,25.7
+3V3_SPI3_PWR  (via drill 0.3, 0.35)
  Top 0.152: 36.25,30.57 36.25,30.74 C0901.1 36.16,30.51 | 36.25,30.57 36.25,29.78 35.93,29.46 U0911.28 34.98,29.46 34.82,29.3 34.21,29.3 33.96,29.55 | U0911.3 33.96,29.55 | 33.96,29.55 33.71,29.3 33.07,29.3 32.96,29.41 U0911.5 32.91,30.12 32.91,30.89 32.6,31.2 | 28.15,26.44 28.15,24.38 28.31,24.22 R0932.2 29.1,24.05 29.1,22.95 29.75,22.3 R0931.2 | X2251.5 28.15,26.44 | 28.15,26.44 28.15,26.92 28.31,27.08 v29.1,27.08 | U1601.6 61.9,19.14 | 61.9,19.14 61.84,19.14 TP_+3V3_SPI3.TP 61.14,19.84 59.82,19.84 59.27,19.29 v59.27,19.23 | U1601.2 61.4,15.71 62.98,17.29 63.92,17.29 64.07,17.44 64.07,18.33 63.26,19.14 61.9,19.14 | 36.16,30.51 36.21,30.57 36.25,30.57 | 36.16,30.51 38.73,30.51 39.77,29.47 41.04,29.47 41.67,28.84 41.67,27.78 42.06,27.39 42.09,27.39 42.1,27.38 48.43,27.38 48.62,27.57 54.24,27.57 55.37,26.44 v57.2,26.44 57.2,27.83 58.14,28.77 58.14,37.78 56.42,39.51 56.42,40.92 v56.47,40.98 | 32.6,31.2 v29.74,31.2 | 32.6,31.2 32.51,31.29 C0902.1 | 69.61,56.42 68.53,55.34 68.53,54.94 | 69.61,56.42 C1001.1 | R1071.2 73.19,56.42 69.61,56.42 | 68.53,54.94 68.53,52.8 70.47,50.87 U1001.11 U1001.10 69.55,52.39 v69.55,52.58 | C1002.1 68.53,54.94
  Bottom 0.152: v29.1,27.08 29.1,30.57 v29.74,31.2 | v57.2,26.44 57.2,24.77 58.17,23.8 58.17,21.59 59.27,20.48 v59.27,19.23 | v69.55,52.58 65,52.58 61.06,48.64 61.06,48.62 60.75,48.31 60.73,48.31 60.48,48.06 60.48,44.3 57.16,40.98 v56.47,40.98
+3V3_USART1_PWR  (via drill 0.3, 0.35)
  Top 0.152: TP_+3V3_USART1.TP 55.93,11.53 56.56,12.16 56.89,12.16 57.2,12.47 | 57.2,12.47 57.77,13.04 U1701.2 57.77,15.04 57.83,15.1 57.83,15.64 v58.47,16.28 | U1701.6 57.27,12.4 57.2,12.47 | C1201.1 63.02,28.73 63.02,29.21 v64.2,30.38 64.75,30.38 C1202.1 65.94,31.57 68.12,31.57 U1211.8
  Bottom 0.152: v64.2,30.38 54.68,30.38 54.03,29.73 54.03,28.23 56.55,25.71 56.55,24.52 56.58,24.48 56.58,19.62 56.01,19.05 56.01,18.59 56.17,18.43 56.21,18.43 56.35,18.29 56.46,18.29 v58.47,16.28
+BAT_VOLTAGE_PWR  (via drill 0.3, 0.35)  (1 unrouted)
  Top 0.152: R0462.2 28.45,40.4 v28.34,40.51 | X2251.2 23.39,22.63 28.31,22.63 v28.47,22.79 29.38,21.72 32.8,21.72 32.8,22.51 33.16,22.88 34.62,22.88 35.23,22.26 36.94,22.26 37.5,22.82 46.27,22.82 v47.04,23.58 | 57.72,10.25 v57.76,10.21 | v60.38,11.2 60.63,11.45 | v60.34,17.55 60.34,17.82 59.65,18.64 59.04,18.64 58.53,19.15 58.47,19.15 57.5,19.15 v57.45,19.1 | v57.52,23.62 57.48,23.58 v55.77,23.58
  Bottom 0.152: v28.34,40.51 28.47,40.38 v28.47,22.79 | v57.76,10.21 59.39,10.21 v60.38,11.2 60.38,17.55 v60.34,17.55 | v57.52,23.62 57.2,23.3 57.2,21.12 57.45,20.87 v57.45,19.1 | v55.77,23.58 55.73,23.54 55.69,23.58 51.24,23.58 51.16,23.66 50.72,23.66 50.65,23.58 v47.04,23.58
ADC_MUX1_P1
  Top 0.152: U2011.1 34.86,7.91 34.34,7.39 34.34,6.77 | 34.34,6.77 R2001.2 | 34.34,6.77 26.41,6.77 C2011.1 25.03,6.45 L2011.1
ADC_MUX1_P1_L
  Top 0.152: L2011.2 R2011.1
ADC_MUX1_P5
  Top 0.152: U2011.5 37.02,12.14 R2002.2 37.04,12.15 36.25,12.95 30.06,12.95 29.88,12.74 C2061.1 29.09,12 L2061.1
ADC_MUX1_P5_L
  Top 0.152: R2061.1 L2061.2
ADC_MUX2_P1
  Top 0.152: R2003.1 38.15,6.77 38.15,7.39 38.67,7.91 U2021.1 38.63,8.34 38.63,9.3 38.15,9.77 28.63,9.77 28.47,9.61 28.47,8.45 L2021.2 C2021.1
ADC_MUX2_P1_L
  Top 0.152: R2021.2 26.09,8.19 L2021.1
ADC_MUX2_P5  (via drill 0.3)
  Top 0.152: R2004.1 40.67,11.48 U2021.5 40.17,10.21 39.9,9.93 39.26,9.93 39.11,10.08 v28,10.08 v27.99,10.09 | L2071.2 30.53,16.18 30.53,16.76 29.88,17.41 C2071.1 29.84,17.75 v28.91,17.75
  Bottom 0.152: v27.99,10.09 27.83,10.09 27.52,10.41 27.52,16.36 v28.91,17.75
ADC_MUX2_P5_L
  Top 0.152: L2071.1 R2071.2
ADC_MUX3_P1  (via drill 0.3)
  Top 0.152: 16.87,34.36 16.92,33.73 L2012.1 | U2012.1 34.78,14.73 34.66,14.85 v25.61,14.85 | C2012.1 16.87,34.36 | 16.87,34.36 v16.88,34.38
  Bottom 0.152: v16.88,34.38 16.88,17.12 20.04,13.96 23.24,13.96 24.14,14.85 v25.61,14.85
ADC_MUX3_P1_L
  Top 0.152: R2012.1 16.84,31.67 L2012.2
ADC_MUX3_P5  (via drill 0.3)
  Top 0.152: U2012.5 36.75,18.22 v36.75,18.45 | v35.33,19.08 34.98,19.08 34.74,18.84 33.55,18.84 32.93,19.46 28.74,19.46 28.21,18.93 27.37,18.93 27.36,18.91 27.11,18.91 24.82,21.2 v24.66,21.2 | v16.25,21.68 v17.52,21.68 | v14.66,34.38 15.45,34.38 16.25,35.17 C2062.1 17.47,35.95 L2062.1
  Bottom 0.152: v36.75,18.45 36.12,19.08 v35.33,19.08 | v14.66,34.38 14.66,22 14.97,21.68 v16.25,21.68 | v17.52,21.68 24.18,21.68 v24.66,21.2
ADC_MUX3_P5_L
  Top 0.152: R2062.1 15.13,36.92 15.45,36.6 17.2,36.6 17.2,36.66 L2062.2
ADC_MUX4_P1  (via drill 0.3)
  Top 0.152: U2022.1 38.63,14.85 38.63,15.17 38.79,15.34 41.5,15.34 v41.64,15.49 | v41.49,20.57 41.33,20.57 41.01,20.89 40.53,20.89 39.9,20.25 29.58,20.25 27.52,22.31 19.9,22.31 18.94,23.27 v18.94,23.58 | v19.67,41.36 19.64,41.39 19.64,42.56 C2022.1 19.12,42.94 17.78,44.28 L2022.2
  Bottom 0.152: v41.64,15.49 41.64,20.41 v41.49,20.57 | v18.94,23.58 19.67,24.31 19.67,29.25 19.05,29.87 19.05,37.77 19.67,38.39 v19.67,41.36
ADC_MUX4_P1_L
  Top 0.152: L2022.1 16.13,42.58 R2022.2
ADC_MUX4_P5  (via drill 0.3)
  Top 0.152: U2022.5 40.69,18.35 v40.85,18.35 | v40.69,20.25 40.38,19.93 29.26,19.93 27.04,22 19.42,22 17.99,23.43 v17.99,23.58 | C2072.1 18.67,40.11 L2072.2 17.93,41.1 v18.69,41.86
  Bottom 0.152: v40.85,18.35 40.85,20.09 v40.69,20.25 | v17.99,23.58 17.99,41.05 18.69,41.75 v18.69,41.86
ADC_MUX4_P5_L
  Top 0.152: R2072.2 17.47,39.6 L2072.1
ADC_MUX_GROUP0  (via drill 0.3)
  Top 0.152: U2021.3 39.58,8.47 v39.58,9.14 | U2021.7 39.26,11.39 39.26,10.57 | R2090.2 32.6,13.58 32.74,13.42 34.48,13.42 35.11,13.42 v35.44,13.68 | v34.99,12.34 35.36,11.99 U2011.7 v35.36,10.62 35.45,10.57 39.26,10.57 | v35.93,9.22 35.93,8.45 U2011.3 | 39.26,10.57 v39.58,10.57
  Bottom 0.152: v34.99,12.34 34.99,13.28 v35.44,13.68 | v39.58,9.14 v39.58,10.57 | v35.93,9.22 35.93,10.05 v35.36,10.62
ADC_MUX_GROUP1  (via drill 0.3)
  Top 0.152: U2012.7 35.36,17.3 v34.98,16.92 | U2012.3 35.86,15.56 v35.77,15.65 35.93,15.75 40.97,15.75 v40.97,15.89 | v39.62,19.04 39.62,18.76 39.17,18.15 U2022.7 39.17,17.27 39.63,16.81 39.87,16.81 v39.9,16.84 | U2022.3 39.68,14.66 v39.68,13.9 | R2091.2 v34.29,21.04 v34.28,21.05
  Bottom 0.152: v39.62,19.04 39.62,19.2 39.58,19.32 39.58,20.72 v39.75,20.87 | v34.28,21.05 34.66,20.67 34.66,18.98 35.14,18.5 35.14,17.08 v34.98,16.92 35.77,16.12 v35.77,15.65 | v39.9,16.84 39.92,16.87 40.05,16.87 40.97,15.94 v40.97,15.89 39.7,14.62 v39.68,13.9
ADC_VBG
  Top 0.152: U0711.6 51.33,15.33 51.49,15.17 51.49,11.22 C0711.1
ADC_VIN1N  (via drill 0.3)
  Top 0.152: U0711.2 49.74,20.57 48.63,20.57 48.17,21.03 C0722.1 47.53,20.73 45.93,20.73 v45.61,20.57 | v36.25,13.74 36.55,13.44 36.67,13.56 37.17,13.56 R2002.1 37.08,13.4 v38.14,13.4 | U2011.6 35.86,12.15 v35.93,12.22 | U2012.6 35.86,17.13 v36.08,16.92 | v47.3,18.9 46.7,18.3 46.7,14.68 46.17,14.14 v46.08,14.14
  Bottom 0.152: v35.93,12.22 35.93,12.85 36.25,13.17 v36.25,13.74 36.25,13.78 36.3,13.84 36.3,16.69 v36.08,16.92 | v47.3,18.9 47.3,19.66 46.51,20.45 45.61,20.45 v45.61,20.57 | v38.14,13.4 39.26,13.42 39.42,13.27 45.93,13.27 46.09,13.42 v46.09,14.13 v46.08,14.14
ADC_VIN1P  (via drill 0.3)
  Top 0.152: R2001.1 35.61,6.77 35.61,7.39 35.36,7.64 U2011.2 35.36,8.91 34.98,9.3 33.87,9.3 v33.71,9.14 | 45.77,19.93 45.15,19.93 R2005.1 44.3,19.44 44.03,19.62 34.01,19.62 v33.77,19.37 | 45.77,19.93 48,19.93 48.79,19.14 U0711.3 | v33.71,14.06 34.98,14.06 35.36,14.29 U2012.2 35.36,15.02 35.37,15.04 34.92,15.49 v33.71,15.49 | C0721.1 45.69,19.85 45.77,19.93
  Bottom 0.152: v33.71,9.14 v33.71,14.06 | v33.77,19.37 33.71,19.31 v33.71,15.49
ADC_VIN2N
  Top 0.152: 49.42,17.87 49.26,17.87 48.42,17.02 48.42,15.01 48.2,14.79 48.2,14.42 48.06,14.29 47.11,14.29 46.25,13.37 41.95,13.37 41.7,13.12 R2004.2 | 49.42,17.87 U0711.4 | U2021.6 39.67,12.07 40.63,13.03 40.92,13.03 R2004.2 | 49.42,17.87 47.68,19.62 47.04,19.62 46.41,18.98 46.41,18.44 46.39,18.42 46.39,16.28 | U2022.6 39.82,17.98 39.82,18.29 40.56,19.04 43.22,19.04 43.35,18.91 43.35,17.55 43.31,17.55 42.36,16.6 42.36,13.7 | R2004.2 41.59,13.7 42.36,13.7 | 42.36,13.7 44.86,13.7 46.39,15.23 46.39,16.28 | C0724.1 45.79,16.28 46.39,16.28
ADC_VIN2P  (via drill 0.3)
  Top 0.152: U2021.2 39.17,7.8 v39.42,7.55 39.42,7.22 | 39.42,7.22 39.42,6.77 R2003.2 39.42,7.22 | U2022.2 39.13,14.38 39.13,12.88 v39.11,12.79 | C0723.1 47.85,11.84 47.72,11.84 47.09,12.43 46.72,12.79 | 46.72,12.79 46.45,13.06 42.07,13.06 41.96,12.95 v41.96,12.47 | U0711.5 49.18,15.88 48.91,15.88 48.72,15.7 48.72,13.88 48.51,13.67 47.62,13.67 R2006.1 46.74,12.79 46.72,12.79
  Bottom 0.152: v39.42,7.55 41.96,10.09 v41.96,12.47 41.64,12.79 v39.11,12.79
ANT_LORA  (via drill 0.3)
  Top 0.152: L1082.1 85.25,42.84 X1081.ANT2 | X1081.ANT2 v86.57,42.32 X1081.ANT1 | C1083.2 85.65,42.19 X1081.ANT2
  Bottom 0.152: X1081.ANT3 v86.57,42.32
BNO085_PS0_WAKE_R
  Top 0.152: R0903.1 D0901.A
BNO_CAP
  Top 0.152: U0911.9 31.49,28.51 30.69,28.51 C0903.1
BNO_CLKSEL1_XOUT32
  Top 0.152: U0911.26 35.41,28.51 36.57,28.51 37.83,27.24 Q0921.1 39.71,27.1 C0922.1
BNO_ENV_SCL
  Top 0.152: U0911.15 30.8,24.22 R0932.1
BNO_ENV_SDA
  Top 0.152: U0911.16 32.91,25.31 32.91,24.7 32.12,23.9 R0931.1
BNO_H_CSN
  Top 0.152: R0904.2 33.95,24.14 U0911.18
BNO_INTN
  Top 0.152: U0911.14 30.39,25.96 R0902.2
BNO_MISO
  Top 0.152: U0911.20 35.4,25.49 R0901.2
BNO_PS0_WAKE
  Top 0.152: U0911.6 31.49,29.93 30.85,29.93 R0903.2
BNO_XIN32
  Top 0.152: U0911.27 35.39,28.98 36.57,28.98 37.18,29.6 Q0921.2 38.47,29.6 C0921.1
BRIDGE_N1
  Top 0.152: R2061.2 23.01,12 21.03,13.98 20.04,13.98 18.06,15.96 4.62,15.96 X2211.3
BRIDGE_N2
  Top 0.152: R2071.1 26.74,17.25 25.49,18.5 25.49,19.38 23.17,21.69 19.13,21.69 14.86,25.97 5.29,25.97 X2211.7
BRIDGE_N3
  Top 0.152: R2062.2 4.62,35.97 X2212.3
BRIDGE_N4
  Top 0.152: X2212.7 4.62,46.01 9.72,40.9 R2072.1
BRIDGE_P1  (via drill 0.3)
  Top 0.152: X2211.2 9.66,13.42 14.18,13.42 v14.66,12.95 | v14.97,6.28 15.31,6.61 20.19,6.61 R2011.2
  Bottom 0.152: v14.66,12.95 14.66,6.6 v14.97,6.28
BRIDGE_P2  (via drill 0.3)
  Top 0.152: v12.75,6.92 19.58,6.92 19.9,7.23 21.64,7.23 22.59,8.19 R2021.1
  Bottom 0.152: X2211.6 13.07,20.01 13.07,7.23 v12.75,6.92
BRIDGE_P3
  Top 0.152: R2012.2 14.96,32.97 14.5,33.43 9.66,33.43 X2212.2
BRIDGE_P4
  Top 0.152: X2212.6 14.89,43.51 15.29,43.9 16.07,43.9 R2022.1
BUZZER
  Top 0.152: R2121.1 62.05,52.44 BUZZER+.1
ESP_CTS  (via drill 0.3)
  Top 0.152: U1211.7 70.29,29.78 v70.23,29.72 | v48.7,32.25 48.56,32.11 46.08,32.11 R1257.1
  Bottom 0.152: v70.23,29.72 69.93,29.72 67.85,31.8 59.64,31.8 59.4,31.56 50.35,31.56 49.66,32.25 v48.7,32.25
ESP_RTS  (via drill 0.3, 0.35)
  Top 0.152: R1266.1 50.07,29.62 51.25,29.62 51.33,29.7 53.31,29.7 53.39,29.78 v54.82,29.78 | U1211.16 70.38,16.49 v70.38,17.39 | v65.48,29.64 65.48,29.37 65.62,29.24 65.62,28.35 65.89,28.15 66.23,27.8 67.75,27.8 68.35,27.21 70.47,27.21 v70.6,27.08
  Bottom 0.152: v70.38,17.39 70.54,17.87 70.54,20.02 70.35,20.21 70.35,26.83 v70.6,27.08 | v54.82,29.78 55.14,29.97 55.81,29.97 55.81,29.96 55.83,29.96 56.15,29.65 56.15,29.63 56.82,28.96 58.35,28.96 59.08,29.69 65.43,29.69 v65.48,29.64
ESP_RX  (via drill 0.3)
  Top 0.152: R1271.1 52.63,38.49 v52.63,37.9 | U1211.21 80.29,13.97 v80.06,13.74
  Bottom 0.152: v80.06,13.74 80.06,27.28 81.35,28.56 81.35,33.54 81.99,34.19 81.99,34.96 81.8,35.16 81.74,35.21 81.74,35.65 81.99,35.9 81.99,36.59 81.35,37.24 81.35,37.78 81,38.12 78.62,38.12 77.62,37.12 75.41,37.12 74.34,38.19 72.7,38.19 72.43,37.93 68.51,37.93 67.9,37.32 53.21,37.32 v52.63,37.9
ESP_TX
  Top 0.152: U1211.22 R1272.1
EXTI9_I2C1_ADC_DRDY
  Top 0.152: U0711.12 57.35,16.6 R0731.2
GND  (via drill 0.3, 0.35)  (118 unrouted)
  Top 0.152: v88.32,44.22 88.51,44.22 X1081.GND4 | 88.51,45.49 v88.32,45.49 v87.05,45.49 87.03,45.5 87.03,46.57 C1082.1 87.58,47.11 87.58,48.25 87.1,48.73 C1071.2 | 88.51,45.49 v89.59,45.49 89.14,45.49 X1081.GND4 | v89.59,44.22 88.64,44.22 | v88.32,44.22 88.64,44.22 | 88.64,44.22 X1081.GND1 | v87.05,44.22 v88.32,44.22 | 88.51,45.49 X1081.GND4 | X1081.GND3 88.32,39.97 v88.32,40.41 88.64,40.73 X1081.GND2 89.15,40.85 v89.59,40.41 | X1081.GND3 87.87,40.41 v87.05,40.41 v87.05,39.14 86.83,39.36 C1083.1 85.6,39.31 v85.6,38.49 | v89.59,39.14 89.14,39.14 X1081.GND3 | v88.32,39.14 88.32,39.59 X1081.GND3 | v82.89,48.25 82.77,48.37 U1071.2 | 51.49,56.52 S0212.1 55.4,56.52 BUZZER-.1 | 51.49,56.52 51.41,56.52 51.31,56.43 51.31,52.48 | C2132.2 38.79,49.95 | 38.79,49.95 R0441.1 39.52,49.86 C0311.2 | C2132.2 37.56,50.55 v37.06,50.55 | U0101.63 48.31,43.66 | 49.25,43.59 49.25,43.9 v52.44,43.9 52.44,44.54 53.07,45.17 C0451.2 53.07,47 52.05,48.03 51.33,48.03 | 49.25,43.59 R0221.1 | v48.31,43.59 48.31,43.66 | U1411.1D 57.75,1.87 C1321.2 v58.47,1.84 | U1411.1C U1411.1D | U1411.2D U1411.1D | v83.24,43.78 83.28,43.74 C1093.1 C1091.1 | 22.28,45.02 X2253.10 19.28,44.22 C2022.2 | 22.28,45.02 22.44,45.17 26.98,45.17 C0461.2 R0461.1 29.18,44.87 v29.64,44.42 30.25,45.03 30.25,45.23 30.38,45.36 30.58,45.36 30.73,45.51 v30.73,46.21 | U0101.18 36.64,43.66 v36.72,43.75 36.72,45.88 C0401.2 36.32,46.51 v36.48,46.66 | U0911.25 34.18,27.96 | 34.18,27.96 U0911.10 31.26,27.96 30.85,27.55 29.58,27.55 28.93,28.2 C0903.2 | v34.18,28.66 34.18,27.96 | U0911.2 34.46,30.37 v34.34,30.89 34.49,30.89 C0901.2 | U2011.4 36.85,8.38 37.56,7.67 37.56,6.21 37.69,6.08 38.79,6.08
  Top 0.152: C0722.2 48,22.63 48,24.85 48.31,25.17 48.93,25.17 C0752.2 49.58,25.81 49.9,25.49 51.81,25.49 51.96,25.33 52.36,24.93 52.36,23.66 53.07,22.95 53.07,19.77 55.93,19.77 56.54,20.38 C0702.2 C0701.2 58.5,20.38 v58.56,20.32 | U0711.8 U0711.7 | 60.81,2.67 U1411.2B | U0611.4 U0611.3 U0611.2 | U0611.2 U0611.1 v53.07,30.25 | 52.97,6.32 53.55,6.9 C1501.2 55.9,7.54 C1802.2 | 52.97,6.32 53.07,6.32 53.07,5.17 52.68,4.77 51.88,4.77 | 52.97,6.32 U1511.4 | U1311.G3 U1311.13 52.35,3.11 | U1311.G3 51.65,4.53 51.88,4.77 | 51.88,4.77 49.99,4.77 C2111.2 48.79,5.98 C1502.2 48.51,6.94 47.8,6.94 C1521.2 | C1802.2 57.98,8.03 59.09,8.03 59.95,7.17 60.73,7.17 61.65,8.08 C1421.2 61.76,8.4 v62.4,7.76 | C1113.2 69.89,13.76 | 68.63,16.28 68.63,15.01 69.89,13.76 | 68.63,16.28 68.51,16.4 U1211.15 | 62.29,14.37 C1801.2 62.14,13.9 v62.89,13.9 | 62.29,14.37 62.4,14.48 U1601.4 | U1801.4 59.77,12.9 59.77,14.28 | 62.29,14.37 61.49,14.37 61.12,14.74 60.24,14.74 59.77,14.28 | U1701.4 56.43,14.63 56.27,14.43 56.29,13.03 55.78,12.87 55.93,12.87 U0711.9 v54.98,12.15 | 68.63,16.28 63.7,16.28 C1601.2 63.53,16.45 v63.53,15.77 | C0723.2 48.96,11.36 C0711.2 50.2,12.49 U0711.8 | C0723.2 46.71,9.11 46.71,8.03 C1521.2 | C0921.2 C0922.2 45.62,27.08 48.81,27.08 48.99,27.26 53.75,27.26 v54.55,26.46 54.55,26.4 54.52,26.43 v54.55,26.45 | 51.31,52.48 C0331.+ 51.33,51.19 51.33,48.03 | C0332.2 51.33,48.03 | R0202.1 66.11,10.58 H2321.B2,8 | X0201.9 68.63,3.26 68,2.63 66.89,2.63 66.09,3.42 X0201.5 X0201.3 64.82,2.95 63.81,1.94 C1401.2 60.92,2.67 60.81,2.67 | C1521.2 48.18,6.56 v48.18,6.47 47.58,7.07 40.89,7.07 | C1301.2 48,1.36 49.11,2.47 v49.58,2.47
  Top 0.152: C1802.2 57.19,8.8 v56.47,8.08 | C1701.2 59.48,16.98 v59.48,17.73 58.31,17.73 v58.31,18.62 | C0601.1 55.63,40.1 v55.28,40.45 | 69.89,13.76 69.76,13.76 v69.9,13.74 | 52.35,3.11 U1311.4 U1311.3 52.35,3.11 | v44.66,35.65 44.58,35.57 U0101.47 44.64,34.64 44.7,34.58 44.7,33.94 45.11,33.53 49.64,33.53 v49.74,33.43 | 59.77,14.28 59.68,14.28 v59.58,14.38 | 16.55,38.52 17.99,38.51 18.78,38.51 | 16.55,38.52 X2212.4 | X2251.10 17.2,28.98 16.72,28.51 11.01,28.51 X2211.8 | v40.69,14.69 40.22,14.69 40.22,14.22 | v38.49,16.92 37.81,16.92 C2001.2 | 34.03,3.38 VIN-.1 30.85,4.38 30.21,5.17 26.42,5.17 | 34.03,3.38 35.18,3.38 v36.09,2.47 | U2012.4 36.8,15.17 v37.52,15.17 37.52,14.22 37.68,14.06 38.47,14.06 38.79,13.74 38.79,13.27 38.47,12.95 38.47,12.31 38.63,12.15 39.26,12.15 40.22,13.11 40.22,14.22 | U0711.8 49.42,12.63 v48.63,12.63 | v37.52,4.85 38.63,4.85 38.79,5.01 38.79,6.08 | v35.93,4.85 34.03,3.38 | 22.28,45.02 22.28,45.17 18.92,48.53 H2331.B2,8 | U0611.7 54.19,36.53 v54.19,33.74 54.19,31.59 U0611.2 | v68.47,25.65 68.52,25.7 79.15,25.7 80.41,26.96 80.41,31.29 U1211.2 | C2121.2 60.48,48.92 v60.53,48.84 | v31.14,12.22 31.14,11.24 C2061.2 | C2021.2 31.19,8.33 v31.19,7.4 | v31.17,18.65 31.17,17.73 C2071.2 | 16.55,38.52 16.26,38.52 16.25,38.51 C2062.2 | X2252.10 19.58,36.6 | 19.58,36.6 19.58,35.82 C2012.2 | 19.58,36.6 19.26,36.6 18.94,36.92 18.94,38.35 18.78,38.51 | 18.78,38.51 18.96,38.51 C2072.2 | 26.42,5.17 19.26,5.17 v19.1,5.33 | 26.42,5.17 C2011.2 | v7.51,10.73 18.94,10.73 18.94,10.75 H2311.B2,8 | U2022.4 40.17,14.26 40.22,14.22 | U1311.G2 U1311.G3 | 60.81,2.67 v60.7,2.79 | 40.89,7.07 39.9,6.08 38.79,6.08
  Top 0.152: U2021.4 40.89,7.07 | v44.5,17.55 44.03,17.08 v44.03,15.01 44.03,17 44.58,17.55 45.68,17.55 C0721.2 | C0213.2 49.99,55.03 51.49,56.52 | v43.87,53.11 44.5,53.11 45.14,52.48 51.31,52.48 | C2132.2 C0413.2 35.61,50.43 v35.61,51.84 | C0412.2 38.79,51.43 38.79,49.95 | C1592.2 48.31,45.3 48.31,43.66 | C0403.2 48.57,44.27 49.25,43.59 | v37.5,37.86 36.81,37.16 U0101.31 34.84,37.16 C1591.1 | C1066.2 v79.14,45.84 v79.14,45.83 | C1005.2 76.86,43.17 75.53,43.17 v75.49,43.21 | 72.35,48.55 72.42,48.62 | U1001.25 73.47,49.88 U1001.2 74.53,50.77 74.78,51.02 76.35,51.02 76.79,50.57 | U1001.25 | U1001.5 72.41,50.94 | 72.41,50.94 U1001.25 | 72.41,50.94 U1001.8 71.53,52 70.7,52.83 70.7,54.77 70.79,54.86 v70.79,55.4 | 72.41,50.94 U1001.25 | U1001.25 72.37,49.83 72.37,48.84 72.39,48.84 U1001.20 73.76,47.47 v73.76,46.62 | U1111.12 77.95,41.01 v78.46,41.53 | C1065.1 79.7,38.87 v78.85,39.72 | v70.84,57.05 70.93,57.14 C1003.2 | Q1011.4 76.79,50.65 | 76.79,50.65 76.79,50.57 | 76.79,50.57 76.79,48.06 v77.07,47.78 | C1004.2 75.14,45.85 v74.58,45.29 | C1067.2 81.97,50.66 | C1072.2 82.89,46.72 v82.89,47.34 | C1001.2 66.46,56.55 v66.45,56.54 66.27,56.36 C1002.2 | v31.02,32.39 31.68,32.39 31.84,32.54 C0902.2 32.64,32.59 v33.33,31.9 | Q1011.2 79.19,56.22 v78.34,57.07 | v77.8,50.7 77.75,50.65 76.79,50.65 | C0410.1 32.66,43.54 v32.66,44.02 | U0811.12 66.83,41.58 v66.83,41.76 | v65.53,26.11 65.53,27.91 C1201.2 64.62,28.83 v63.7,28.83 | v66.65,29.97 66.65,30.75 C1202.2 | C0723.2 48.09,10.48 v48.78,10.48
  Bottom 0.152: 78.96,48.27 82.87,48.27 v82.89,48.25 v82.89,47.34 | H2341.B2,8 68.06,46.63 68.14,46.62 v73.76,46.62 73.79,46.6 73.79,45.26 | 14.34,48.77 H2331.B2,8 20.08,49.94 v34.34,49.94 34.34,50.57 v35.61,51.84 | 14.34,48.77 9.84,48.77 X2212.8 8.15,48.51 7.51,47.87 7.51,38.51 | 7.51,38.51 7.51,28.51 | 7.51,28.51 7.51,18.5 | 7.51,18.5 v7.51,10.73 | 7.51,18.5 X2211.4 | 7.51,38.51 X2212.4 | v49.58,2.47 U1311.G2 | v38.49,16.92 38.1,15.75 v37.52,15.17 | v40.69,14.69 44.03,14.69 | 44.03,14.69 46.57,14.69 v48.63,12.63 | v69.9,13.74 65.93,10.73 | v54.98,12.15 54.98,15.81 55.14,15.96 57.84,15.96 58,15.81 58,14.69 58.31,14.38 v59.58,14.38 59.48,14.48 v59.48,17.73 | v62.4,7.76 62.93,8.29 63.5,8.29 65.93,10.73 | 69.9,3.42 69.9,7.39 66.29,10.43 | 66.29,10.43 65.93,10.73 | v37.52,4.85 v35.93,4.85 31.64,4.85 31.33,5.17 31.33,7.54 | v19.1,5.33 19.1,10.59 H2311.B2,8 | 65.93,10.73 62.89,13.77 v62.89,13.9 | v58.56,20.32 58.05,19.81 58.05,18.88 v58.31,18.62 | 54.98,43.9 54.98,40.75 v55.28,40.45 | 54.98,43.9 v52.44,43.9 | 54.98,43.9 59.54,43.9 59.54,47.85 v60.53,48.84 | v36.09,2.47 v37.68,2.47 | v53.07,30.25 53.07,27.93 v54.55,26.45 | X2251.10 23.07,29.78 25.43,29.78 26.25,28.96 v26.25,28.35 | 31.33,7.54 31.33,11.85 v31.14,12.22 31.33,12.4 31.33,18.17 v31.17,18.65 | v31.19,7.4 31.33,7.54 | 14.42,48.85 14.34,48.77 | 7.51,28.51 X2211.8 | v58.47,1.84 59.74,1.84 v60.7,2.79 | H2321.B2,8 65.94,10.77 66.29,10.43 | 69.9,3.42 68.63,3.42 X0201.9 | v49.74,33.43 50.33,33.43 50.97,34.06 53.87,34.06 v54.19,33.74 | v69.9,1.04 69.9,3.42 | v44.03,15.01 44.03,14.69 | v37.5,37.86 37.03,37.86 36.25,37.08 34.42,37.08 32.66,35.31 32.66,33.05 33.09,32.61 33.09,31.38 33.07,31.36 33.55,30.89 v34.34,30.89
  Bottom 0.152: v45.23,39.05 44.66,38.48 v44.66,35.65 | v83.24,43.78 81.84,45.17 79.8,45.17 v79.14,45.83 78.96,45.83 78.96,47.78 | 78.96,48.27 78.96,47.78 | 78.96,48.27 78.96,49 78.5,49.45 v77.94,49.45 | v78.85,39.72 78.46,40.11 v78.46,41.53 76.79,43.21 v75.49,43.21 73.79,44.91 73.79,45.26 | v70.79,55.4 70.79,56.49 | 70.79,56.49 70.79,57 v70.84,57.05 | v77.07,47.78 78.96,47.78 | v74.58,45.29 73.81,45.29 73.79,45.26 | v66.45,56.54 70.74,56.54 70.79,56.49 | v39.11,41.68 38.79,41.68 v36.72,43.75 | v78.34,57.07 78.34,51.23 v77.8,50.7 | v32.66,44.02 32.41,44.27 32.41,44.49 32.09,44.81 31.63,44.81 31.23,44.42 v29.64,44.42 28.23,43.01 v28.23,41.87 | v65.53,26.11 66,25.65 v68.47,25.65 | v63.7,28.83 65.51,28.83 v66.65,29.97 | v72.42,48.48 71.46,49.43 v71.46,50.38 v73.37,50.38 73.37,49.43 v72.42,48.48
  other vias: 83.43,42.29 41.29,41.71 40.53,7.71 69.27,6.76 27.99,19.46 34.32,34.9 33.79,36.13 17.81,20.52 25.61,16.1 32.95,11.58 53.65,5.91 27.54,34.7 24.8,47.52 21.38,42.39 36.9,44.61 26.03,45.37 26.93,27.13 27.19,24.69 30.23,20.88 53.13,35.34 86.2,37.91 87.8,35.76 86.69,43.41 86.82,41.22 84.43,14.88 89.74,14.91 89.46,12.22 86.62,10.67 82.37,9.37 81.92,11 82.22,19.02 82.32,27.94 26.4,40.16 33.54,39.62 29.8,34.54 41.01,10.31 30.66,23.04 31.14,25.37 41.87,26.86 20.84,32.23 18.7,28.5 54.85,24.12 48.1,24.14 50.94,23.13 79.1,33.32 80.22,35.41 53.98,35.27 55.28,35.37 40.06,2.88 23.46,42.9 64.82,18.87 78.16,35.56 27.06,30.43 74.92,40.63 72.96,42.84 73.04,40.86 82.62,37.83 82.69,33.77 69.71,40.25 76.46,26.92 76.28,29.57 56.78,29.76 53.25,28.46 51.45,28.44 76.91,52.7 41.32,36.31 64.57,38.85 62.34,35.88 69.05,36.82 71.17,23.88 71.12,22.15 70.99,25.53 71.3,28.57 69.29,33.02 59.78,23.35 69.45,19.63 61.37,21.08 61.55,22.23 62.89,22.25 29.3,39.57 26.38,36.47 27.62,36.45 42.95,47.6 44.76,47.24 49.64,37.1 50.91,36.41 53.6,10.29 55.17,10.79 49.84,9.63 37.03,48.39 69.04,27.81 55.63,33.73 57.02,33.73 81.57,51 83.35,50.11 80.96,52.68
  pour Top: 13.11,59.41 78.26,59.39 arc-87 81.49,56.34 81.49,53.03 arc45 82.03,51.98 83.6,50.31 arc45 85.26,49.73 86.59,49.76 87,49.73 arc-90 91.04,46.23 91.04,12.34 arc-90 88.55,10.08 85.5,9.93 arc90 81.56,6.71 81.51,4.65 arc-90 77.24,0.36 12.88,0.36 arc-90 10.16,3.07 10.16,5.21 arc90 5.46,9.91 3.56,9.91 arc-90 0.54,12.93 0.54,46.41 arc-90 3.74,49.61 5.89,49.61 arc90 10.06,53.77 10.06,57.02 arc-90 12.96,59.36 arc90 13.01,59.39
  pour Bottom: 13.11,59.41 78.26,59.39 arc-87 81.49,56.34 81.49,53.03 arc45 82.03,51.98 83.6,50.31 arc45 85.26,49.73 86.59,49.76 87,49.73 arc-90 91.04,46.23 91.04,12.34 arc-90 88.55,10.08 85.5,9.93 arc90 81.56,6.71 81.51,4.65 arc-90 77.24,0.36 12.88,0.36 arc-90 10.16,3.07 10.16,5.21 arc90 5.46,9.91 3.56,9.91 arc-90 0.54,12.93 0.54,46.41 arc-90 3.74,49.61 5.89,49.61 arc90 10.06,53.77 10.06,57.02 arc-90 12.96,59.36 arc90 13.01,59.39
MCU_NRST
  Top 0.152: C0213.1 48.69,54.63 46.8,56.52 S0212.2 | S0212.2 45.45,56.29 43.07,56.29 41.56,54.77 41.56,49.31 42.2,48.67 42.2,47.13 42.08,47.01 U0101.7 | S0212.2 45.69,56.83 47.73,58.88 77.45,58.88 80.14,56.18 80.14,52.65 81.01,51.79 81.03,51.79 81.28,51.53 81.38,51.63 81.77,51.63 82.78,50.62 82.78,49.12 83.44,48.47 83.44,46.1 83.62,45.91 83.66,45.91 84.09,45.48 84.14,45.43 84.14,39.14 83.56,38.56 83.56,11.52 78.01,5.97 78.01,4.18 75.76,1.94 72.59,1.94 69.78,4.76 X0201.10
MCU_SX_SEL_OUT
  Top 0.152: U1001.19 72.94,47.45 72.92,47.42 R1021.2
MCU_VBAT
  Top 0.152: TP_VBAT.TP C0451.1 51.17,45.89 49.97,47.09 45.47,47.09 45.14,46.76 45.14,46.25 U0101.1
MCU_VDD  (via drill 0.3)
  Top 0.152: U0101.32 35.61,36.66 | 35.61,36.66 36.66,36.66 39.76,38.52 40.68,38.52 v40.72,38.56 | 40.7,43.16 U0101.19 34.93,43.16 | 40.7,43.16 40.7,43.58 45.6,43.58 46.16,44.14 U0101.64 47.59,44.14 47.68,44.22 47.68,44.58 C0403.1 | 40.7,43.16 40.7,39.79 v40.69,39.78 | C0402.1 35.61,36.54 35.61,36.66 | 33.43,45 33.21,44.78 32.17,44.78 32.08,44.88 31.64,44.88 31.54,44.78 R0401.2 | 33.43,45 33.45,45.02 L0411.1 C0410.2 33.98,43.16 34.93,43.16 | 33.43,45 35.32,45 C0401.1 34.87,44.54 34.86,44.54 34.72,44.41 34.72,43.42 34.93,43.21 34.93,43.16
  Bottom 0.152: v40.69,39.78 40.72,39.75 v40.72,38.56
MCU_VDD12  (via drill 0.3, 0.35)
  Top 0.152: 34.04,37.66 U0101.30 36.36,37.66 v37.52,39.14 41.96,39.14 42.47,39.65 42.47,41.73 43.31,42.57 44.65,42.57 v45.09,43 45.25,43.16 U0101.62 | 34.04,37.66 33.82,37.66 33.55,37.4 TP_+1V2_MCU.TP | U1511.6 51.58,9.05 52.44,8.19 54.03,8.19 54.19,8.03 54.5,8.03 54.98,8.5 54.98,8.98 54.19,9.77 54.19,11.68 51.81,14.06 51.81,15.29 51.09,16.01 51.09,20.79 50.83,21.04 48.79,21.04 48.63,21.68 43.87,21.68 v43.71,21.84 | v36.25,24.43 36.46,24.22 39.11,24.22 40.22,25.33 42.24,25.33 42.98,24.59 43.97,24.59 v44.34,24.22 | v45.29,44.78 45.29,45.24 45.98,45.92 46.04,45.92 C1592.1 | C1591.2 34.04,37.66
  Bottom 0.152: v44.34,24.22 44.34,22.47 v43.71,21.84 | v45.29,44.78 45.09,44.58 v45.09,43 | v36.25,24.43 36.09,24.59 34.39,24.59 32.12,26.87 32.12,30.1 32.79,30.77 32.79,31.22 32.77,31.24 32.77,31.49 32.79,31.51 32.79,32.44 32.35,32.88 32.35,35.57 33.79,37.01 C1591.2
  other vias: 33.79,37.41
MCU_VDDA  (via drill 0.35)
  Top 0.152: v34.98,48.97 35.77,48.97 C0413.1 35.92,48.83 34.18,48.83 33.94,48.58 L0411.2 | v36.25,51.21 36.57,51.52 C0412.1 | U0101.13 39.08,47.38 v39.1,47.4
  Bottom 0.152: v36.25,51.21 36.25,50.24 v34.98,48.97 37.52,48.97 v39.1,47.4
MCU_VREF_M
  Top 0.152: U0101.12 39.58,46.6 39.65,46.76 39.65,48.5 R0441.2
PA0
  Top 0.152: U0101.14 38.51,46.26 38.51,47.77 38.15,48.19 C2132.1 38.14,48.67 37.52,48.67 36.81,49.37 35.54,49.37 34.98,49.94 34.98,56.92 36.03,57.97 S2131.1
PA1  (via drill 0.3)
  Top 0.152: v34.66,48.19 35.22,47.63 37.44,47.63 38.08,47 U0101.15
  Bottom 0.152: X2253.8 22.28,42.99 23.39,44.1 23.39,46.92 24.66,48.19 v34.66,48.19
PA2  (via drill 0.35)
  Top 0.152: v37.21,47.08 37.58,46.71 U0101.16
  Bottom 0.152: X2253.9 24.82,46.76 24.97,46.91 35.25,46.91 35.97,47.63 36.65,47.63 v37.21,47.08
PA4
  Top 0.152: C0461.1 R0461.2 28.39,42.48 29.26,42.48 29.26,42.37 | 29.26,42.37 R0462.1 | U0101.20 34.84,42.66 34.55,42.37 29.26,42.37
PA5  (via drill 0.3)
  Top 0.152: U0101.21 34.88,42.14 34.75,42.01 30.52,42.01 30.37,41.87 v30.37,41.84 | v29.43,36.58 29.43,36.88 29.28,37.03 25.25,37.03 X2252.9
  Bottom 0.152: v30.37,41.84 30.06,41.52 30.06,37.08 29.56,36.58 v29.43,36.58
PA6  (via drill 0.3)
  Top 0.152: U0101.22 30.99,41.66 30.37,41.05 27.99,41.05 v27.37,41.66 26.72,42.32 25.45,42.32 X2253.7
  Bottom 0.152: v27.37,41.66 27.52,41.51 27.52,39.47 26.25,38.19 25.29,38.19 23.87,36.76 23.87,35.97 23.23,35.33 X2252.8
PA7  (via drill 0.3)
  Top 0.152: X2252.7 24.9,35.41 25.06,35.41 25.54,35.89 30.92,35.89 v31.01,35.81 | U0101.23 35.14,41.21 32.28,41.21 v31.88,40.81
  Bottom 0.152: v31.88,40.81 31.33,40.25 31.33,38.22 31.88,37.67 31.88,36.68 v31.01,35.81
PA8  (via drill 0.3)
  Top 0.152: U0101.41 41.58,33.79 41.38,33.6 41.38,33.21 41.57,33.03 41.61,33.03 41.74,32.9 42.65,32.9 43.18,32.37 v43.29,32.37 | U1511.7 51.08,9.84 51.33,10.09 52.44,10.09 52.6,10.25 v52.76,10.25 | v43.37,30.36 45.5,30.36 v45.61,30.25
  Bottom 0.152: v45.61,30.25 45.61,28.98 45.3,28.66 45.3,22.16 45.61,21.84 52.28,21.84 52.44,21.68 52.44,10.41 v52.76,10.25 | v43.29,32.37 43.29,30.36 43.28,30.35 v43.36,30.35 v43.37,30.36
PA9  (via drill 0.3, 0.35)
  Top 0.152: X2252.2 19.9,31.52 v19.58,32 | v19.58,37.55 22.59,37.55 22.91,37.85 29.7,37.85 30.63,36.92 31.37,36.92 32.07,36.21 32.07,35.05 32.36,34.77 33.66,34.77 34.24,34.18 35.68,34.18 35.81,34.32 35.81,35.16 36.27,35.61 | v41.96,33.43 42.12,33.59 42.12,34.59 U0101.42 42.08,35.36 41.91,35.53 38.48,35.53 38.03,35.97 36.65,35.97 36.44,35.77 36.43,35.77 36.27,35.61 | U0711.13 56.25,17.87 56.57,18.19 v56.57,18.82 | 57.84,35.33 57.84,29.03 v55.96,27.15 55.12,27.15 54.41,27.87 48.11,27.87 47.93,27.69 42.53,27.69 v42.25,27.97 | 57.84,35.33 57.84,36.6 57.41,37.03 57.41,37.49 57.23,37.67 57.23,37.71 | U0611.6 55.77,36.85 55.77,37.21 56.28,37.71 57.23,37.71 | 36.27,35.61 | 57.23,37.71 57.23,37.74 v57.33,37.85 | v67.92,38.1 68.35,37.67 68.35,35.44 v68.76,35.03 | v69.97,35.05 69.98,35.06 U1111.22 | U0811.22 59.57,35.13 v59.35,35.35 | v57.2,35.36 57.23,35.33 57.84,35.33 | v65.95,17.78 65.93,17.76 R0512.1
  Bottom 0.152: v19.58,32 v19.58,37.55 | v41.96,33.43 41.64,33.11 41.64,28.58 v42.25,27.97 | v55.96,27.15 55.96,26.73 56.89,25.81 56.89,19.14 v56.57,18.82 57.3,18.08 59.08,18.08 59.26,18.26 59.7,18.26 59.87,18.08 61.75,18.08 62.05,17.78 62.05,16.45 63.59,14.91 63.59,14.73 63.9,14.42 64.34,14.42 64.35,14.43 65.56,14.43 65.95,14.82 v65.95,17.78 | v57.33,37.85 57.51,37.67 67.49,37.67 v67.92,38.1 | v69.97,35.05 69.95,35.03 v68.76,35.03 | v59.35,35.35 57.21,35.35 v57.2,35.36
PA10  (via drill 0.3, 0.35)